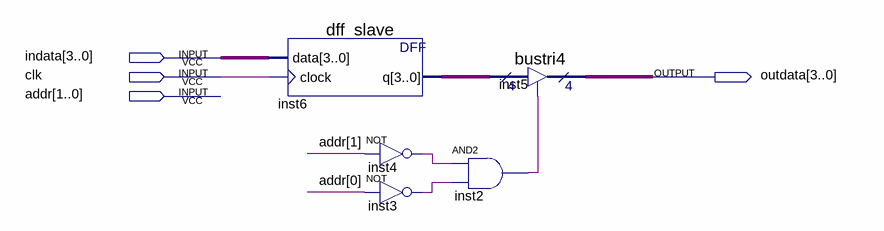
[diagram p0: schematic sheet]
// Quartus schematic slave1.bdf as structural Verilog: 5 symbols, 4 pins
module slave1 (
  input  [3:0] indata,
  input  clk,
  input  [1:0] addr,
  output [3:0] outdata
);

  wire inst2_out, inst3_out, inst4_out;
  wire [3:0] inst6_q;

  dff_slave inst6 (.data(indata), .clock(clk), .q(inst6_q));
  not inst4 (inst4_out, addr[1]);
  not inst3 (inst3_out, addr[0]);
  and inst2 (inst2_out, inst4_out, inst3_out);
  bustri4 inst5 (.enabledt(inst2_out), .data(inst6_q), .tridata(outdata));
endmodule
